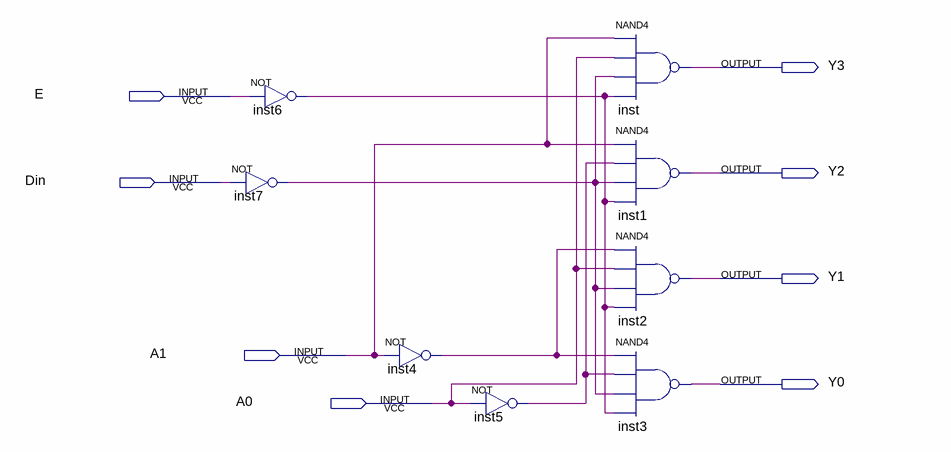
[diagram p0: schematic sheet]
// Quartus schematic demux14.bdf as structural Verilog: 8 symbols, 8 pins
module demux14 (
  input  E,
  input  Din,
  input  A1,
  input  A0,
  output Y3,
  output Y2,
  output Y1,
  output Y0
);

  wire inst4_out, inst5_out, inst6_out, inst7_out;

  not inst6 (inst6_out, E);
  not inst7 (inst7_out, Din);
  not inst4 (inst4_out, A1);
  not inst5 (inst5_out, A0);
  nand inst (Y3, A1, A0, inst7_out, inst6_out);
  nand inst1 (Y2, A1, inst5_out, inst7_out, inst6_out);
  nand inst2 (Y1, inst4_out, A0, inst7_out, inst6_out);
  nand inst3 (Y0, inst4_out, inst5_out, inst7_out, inst6_out);
endmodule
